# EAGLE design IO-001 (EAGLE 9.5.2)

## Sheet 1 of 3
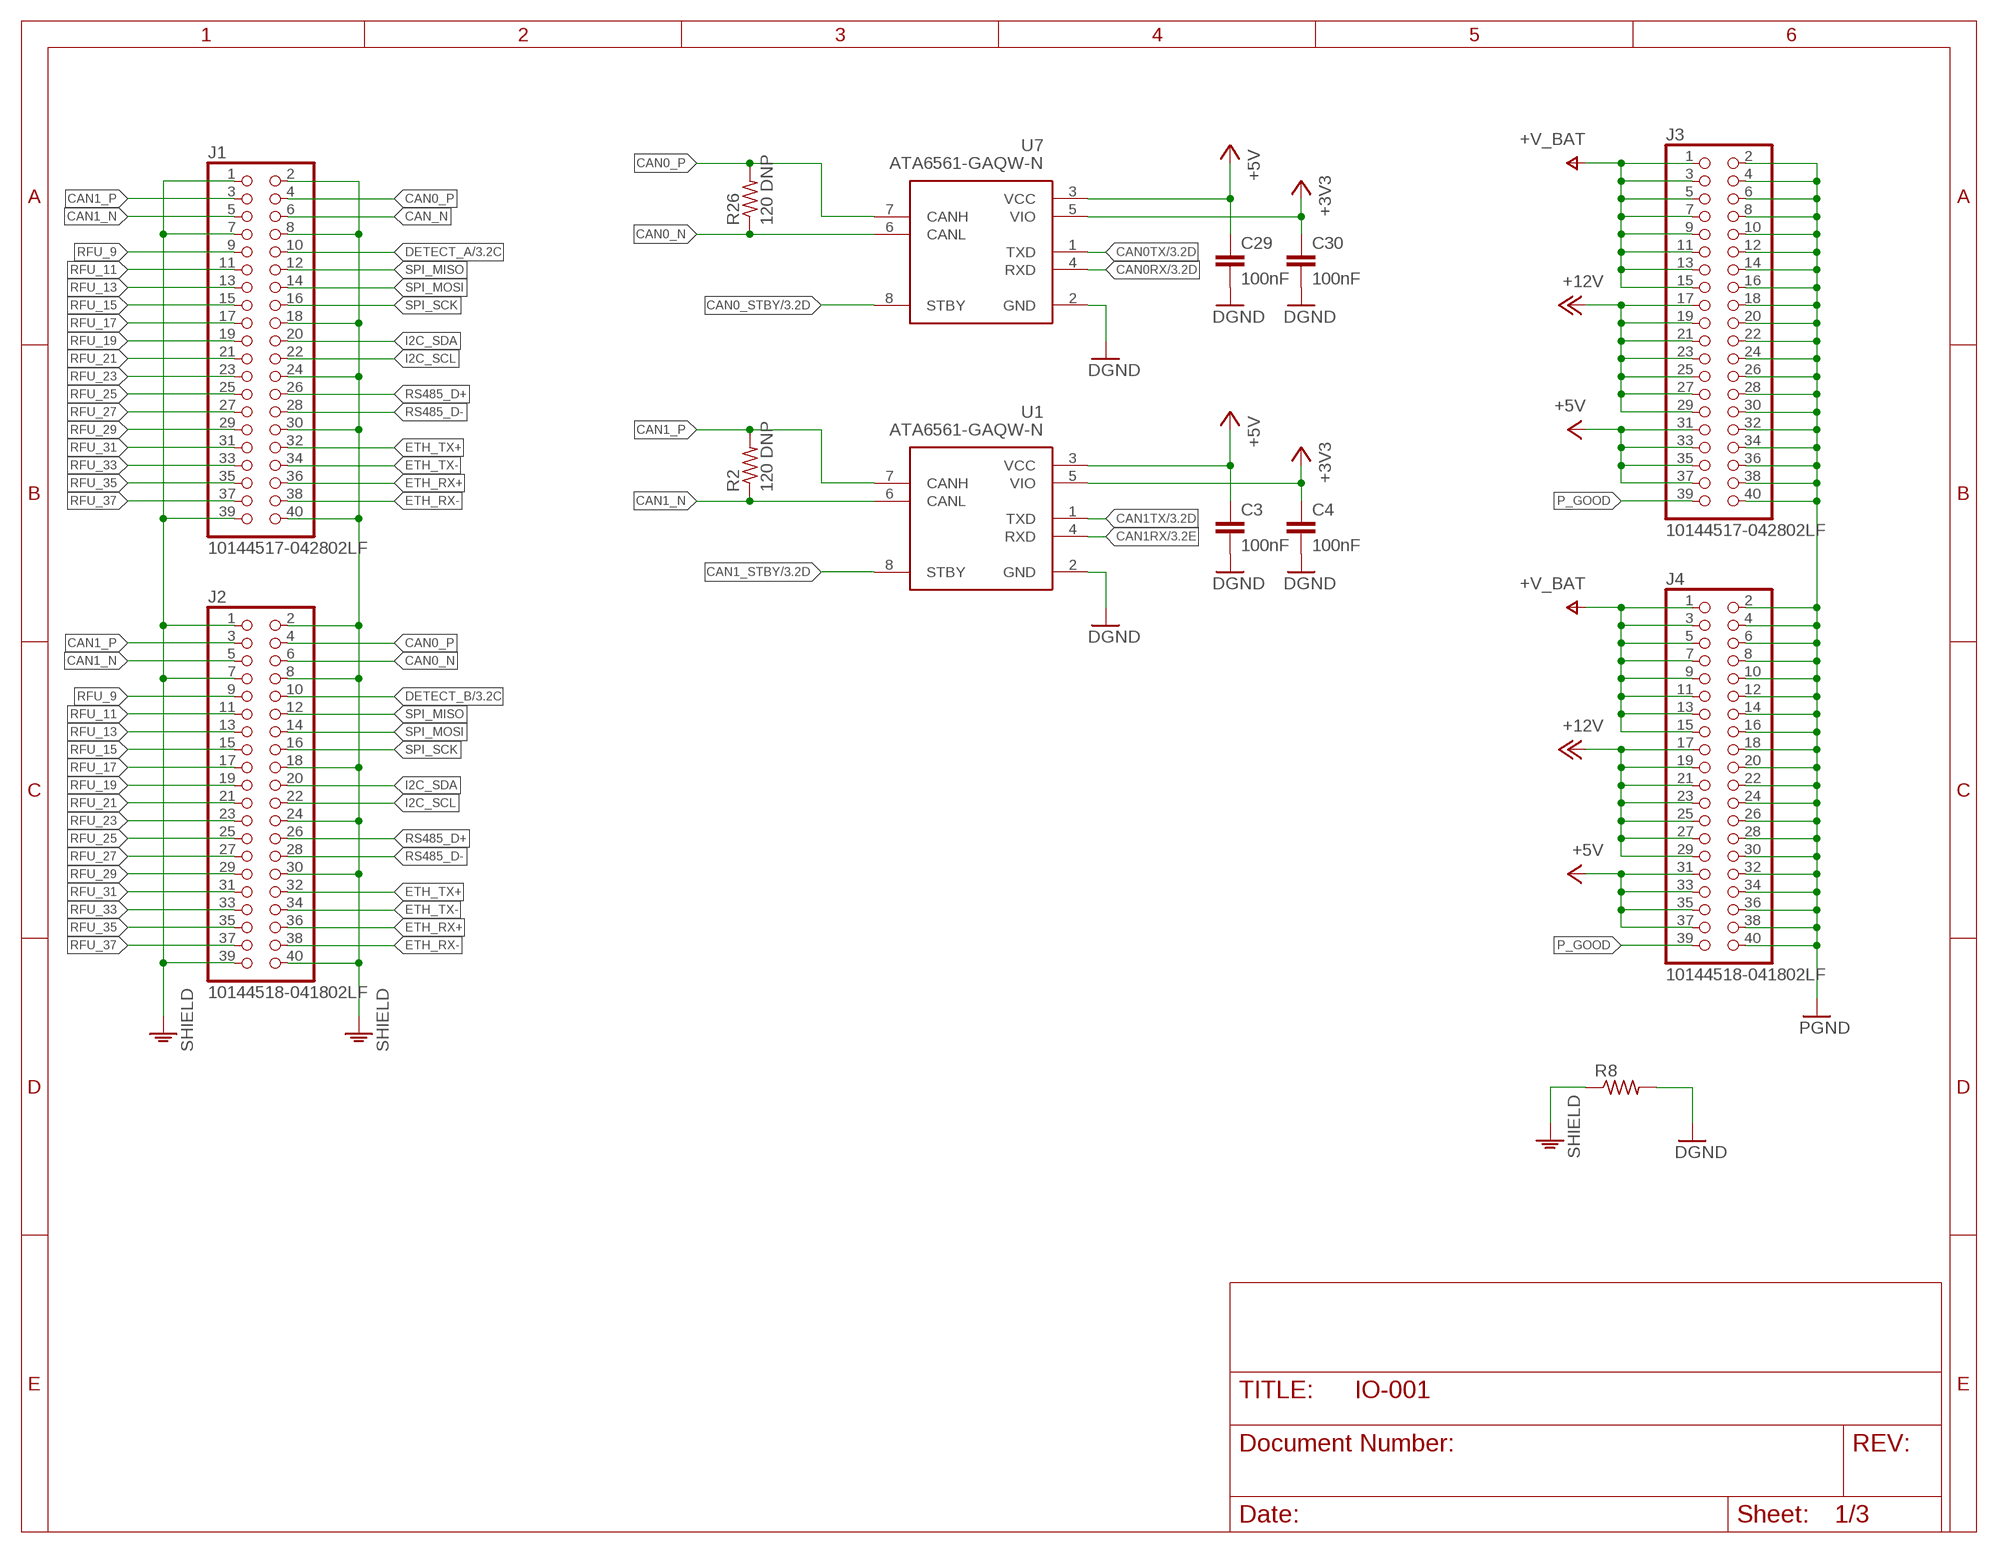
[diagram p0: schematic, sheet 1]

### Parts
C3  100nF  C-EUC0402  [C0402]
C4  100nF  C-EUC0402  [C0402]
C29  100nF  C-EUC0402  [C0402]
C30  100nF  C-EUC0402  [C0402]
J1  10144517-042802LF  [10144517-042802LF]
J2  10144518-041802LF  [10144518-041802LF]
J3  10144517-042802LF  [10144517-042802LF]
J4  10144518-041802LF  [10144518-041802LF]
R2  120 DNP  R-US_R0402  [R0402]
R8  R-US_R0402  [R0402]
R26  120 DNP  R-US_R0402  [R0402]
U1  ATA6561-GAQW-N  [SOIC127P600X175-8N]
U7  ATA6561-GAQW-N  [SOIC127P600X175-8N]

### Nets
+3V3: C4.1 C30.1 U1.5(VIO) U7.5(VIO) ; also sheet 2,3
+5V: C3.1 C29.1 J3.17 J3.19 J3.21 J3.23 J3.25 J3.27 J3.29 J3.31 J3.33 J3.35 J3.37 J4.17 J4.19 J4.21 J4.23 J4.25 J4.27 J4.29 J4.31 J4.33 J4.35 J4.37 U1.3(VCC) U7.3(VCC) ; supply symbol labelled +12V ; also sheet 2
+V_BAT: J3.1 J3.3 J3.5 J3.7 J3.9 J3.11 J3.13 J3.15 J4.1 J4.3 J4.5 J4.7 J4.9 J4.11 J4.13 J4.15
CAN0_N: J2.6 R26.1 U7.6(CANL)
CAN0_P: J1.4 J2.4 R26.2 U7.7(CANH)
CAN0_STBY: U7.8(STBY) ; also sheet 3
CAN0RX: U7.4(RXD) ; also sheet 3
CAN0TX: U7.1(TXD) ; also sheet 3
CAN1_N: J1.5 J2.5 R2.1 U1.6(CANL)
CAN1_P: J1.3 J2.3 R2.2 U1.7(CANH)
CAN1_STBY: U1.8(STBY) ; also sheet 3
CAN1RX: U1.4(RXD) ; also sheet 3
CAN1TX: U1.1(TXD) ; also sheet 3
CAN_N: J1.6
DETECT_A: J1.10 ; also sheet 3
DETECT_B: J2.10 ; also sheet 3
DGND: C3.2 C4.2 C29.2 C30.2 R8.2 U1.2(GND) U7.2(GND) ; also sheet 2,3
ETH_RX+: J1.36 J2.36
ETH_RX-: J1.38 J2.38
ETH_TX+: J1.32 J2.32
ETH_TX-: J1.34 J2.34
I2C_SCL: J1.22 J2.22
I2C_SDA: J1.20 J2.20
P_GOOD: J3.39 J4.39
PGND: J3.2 J3.4 J3.6 J3.8 J3.10 J3.12 J3.14 J3.16 J3.18 J3.20 J3.22 J3.24 J3.26 J3.28 J3.30 J3.32 J3.34 J3.36 J3.38 J3.40 J4.2 J4.4 J4.6 J4.8 J4.10 J4.12 J4.14 J4.16 J4.18 J4.20 J4.22 J4.24 J4.26 J4.28 J4.30 J4.32 J4.34 J4.36 J4.38 J4.40 ; also sheet 2
RFU_9: J1.9 J2.9
RFU_11: J1.11 J2.11
RFU_13: J1.13 J2.13
RFU_15: J1.15 J2.15
RFU_17: J1.17 J2.17
RFU_19: J1.19 J2.19
RFU_21: J1.21 J2.21
RFU_23: J1.23 J2.23
RFU_25: J1.25 J2.25
RFU_27: J1.27 J2.27
RFU_29: J1.29 J2.29
RFU_31: J1.31 J2.31
RFU_33: J1.33 J2.33
RFU_35: J1.35 J2.35
RFU_37: J1.37 J2.37
RS485_D+: J1.26 J2.26
RS485_D-: J1.28 J2.28
SHIELD: J1.1 J1.2 J1.7 J1.8 J1.18 J1.24 J1.30 J1.39 J1.40 J2.1 J2.2 J2.7 J2.8 J2.18 J2.24 J2.30 J2.39 J2.40 R8.1
SPI_MISO: J1.12 J2.12
SPI_MOSI: J1.14 J2.14
SPI_SCK: J1.16 J2.16

## Sheet 2 of 3
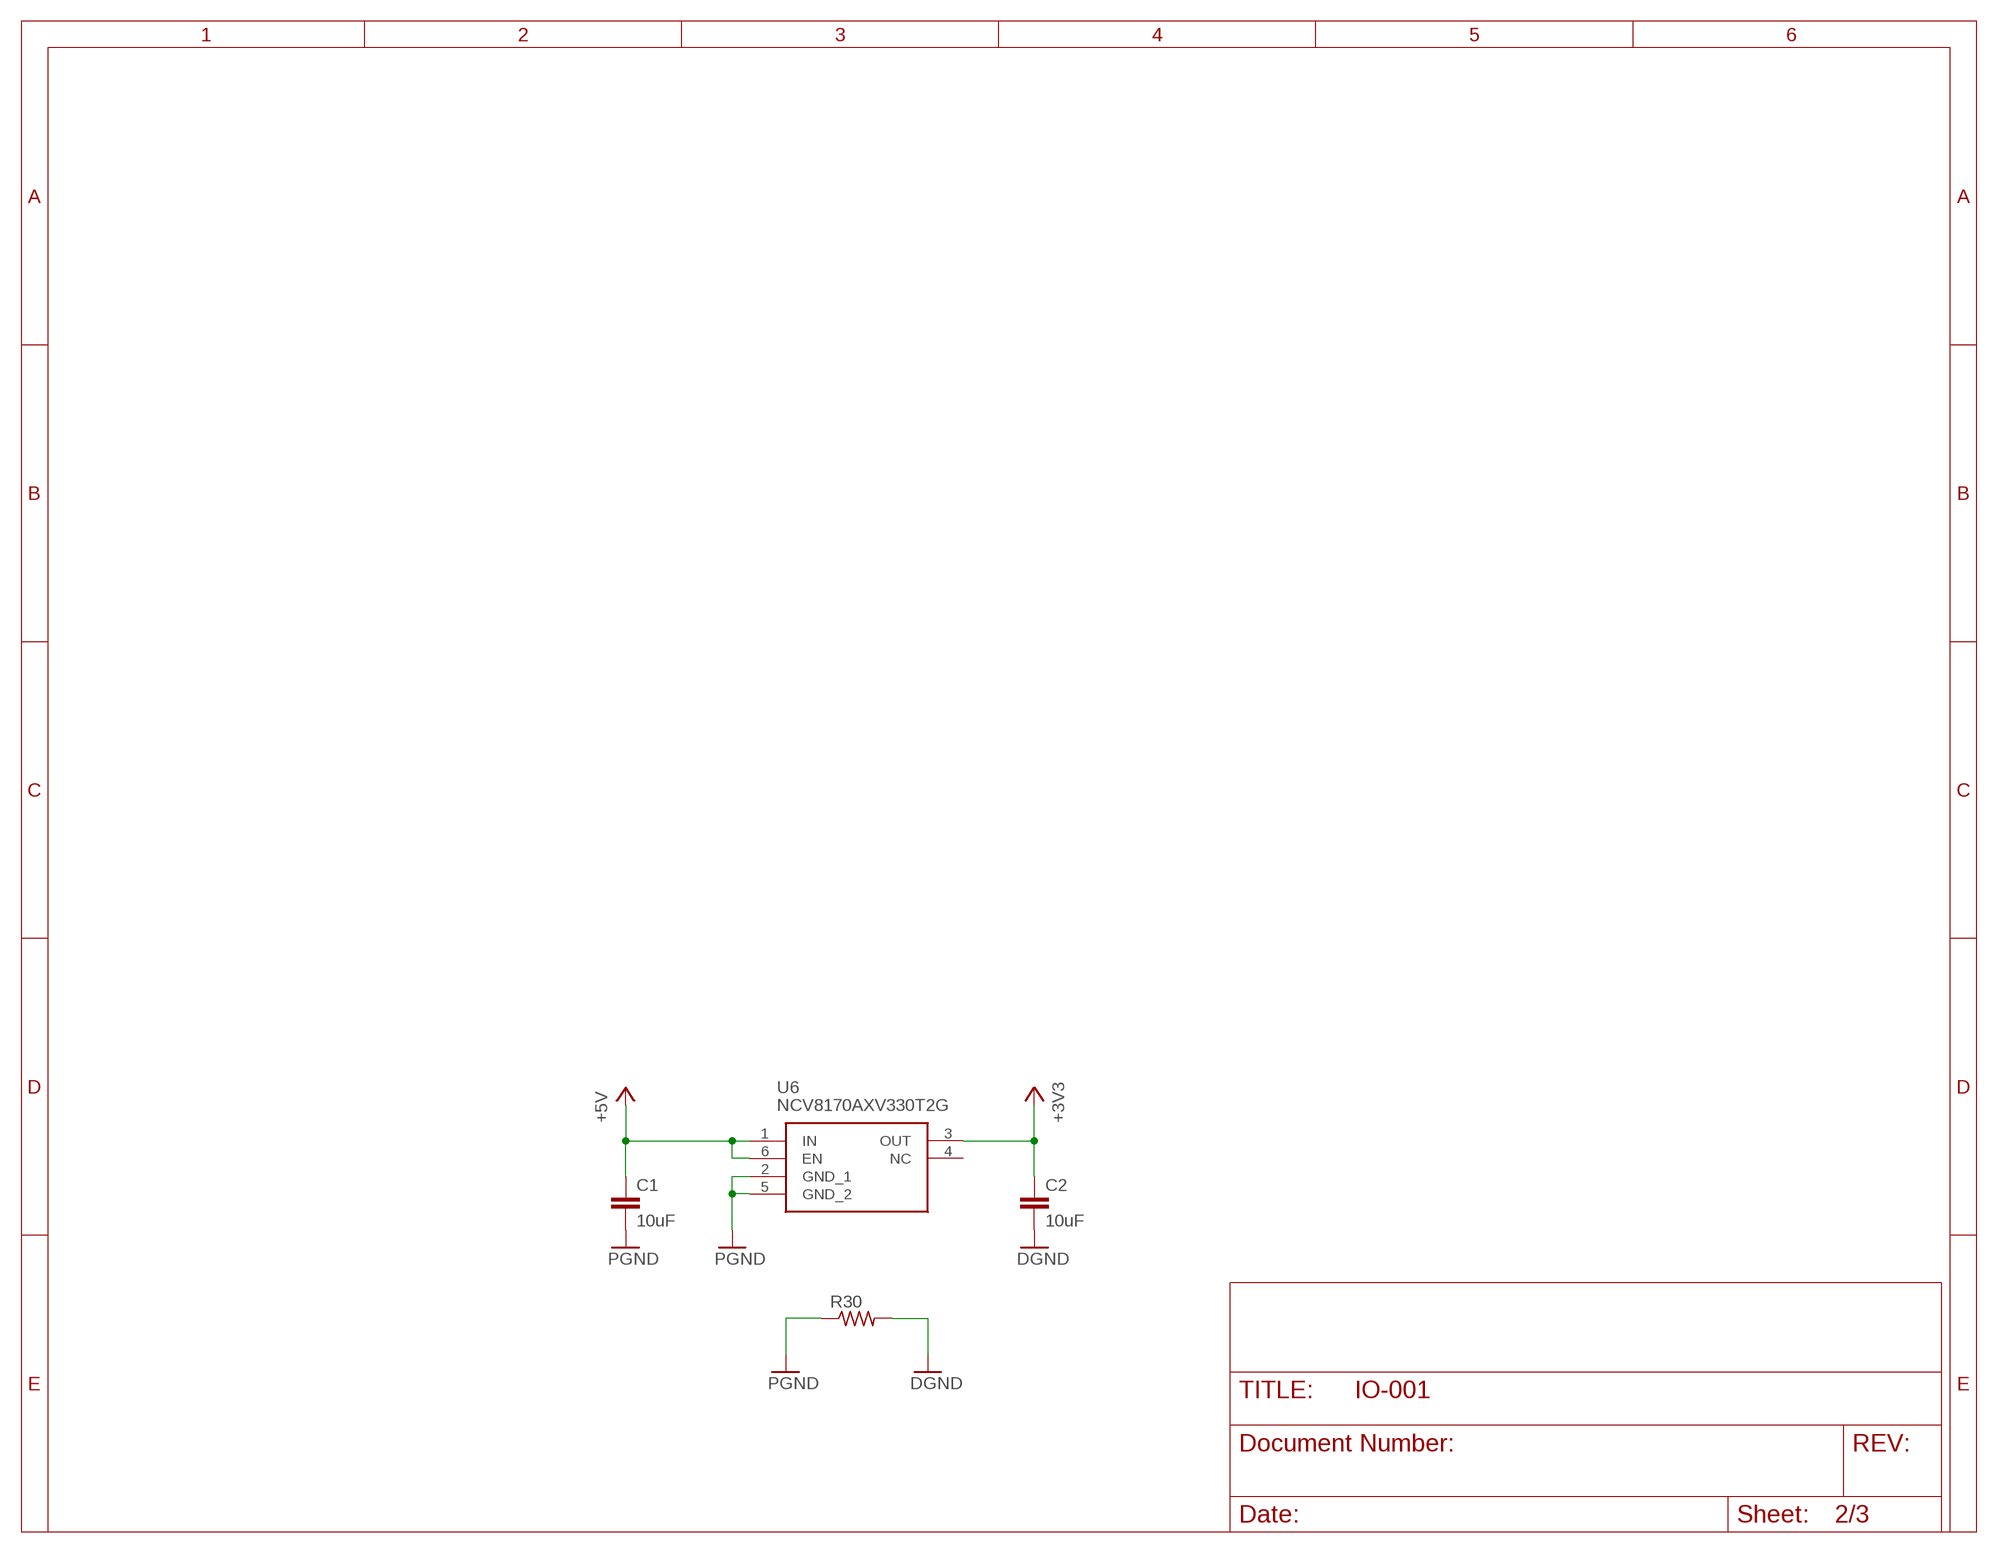
[diagram p1: schematic, sheet 2]

### Parts
C1  10uF  C-EUC0805  [C0805]
C2  10uF  C-EUC0805  [C0805]
R30  R-US_R0402  [R0402]
U6  NCV8170AXV330T2G  [SOTFL50P160X60-6N]

### Nets
+3V3: C2.1 U6.3(OUT) ; also sheet 1,3
+5V: C1.1 U6.1(IN) U6.6(EN) ; also sheet 1
DGND: C2.2 R30.2 ; also sheet 1,3
PGND: C1.2 R30.1 U6.2(GND_1) U6.5(GND_2) ; also sheet 1
Unconnected: U6.4(NC)

## Sheet 3 of 3
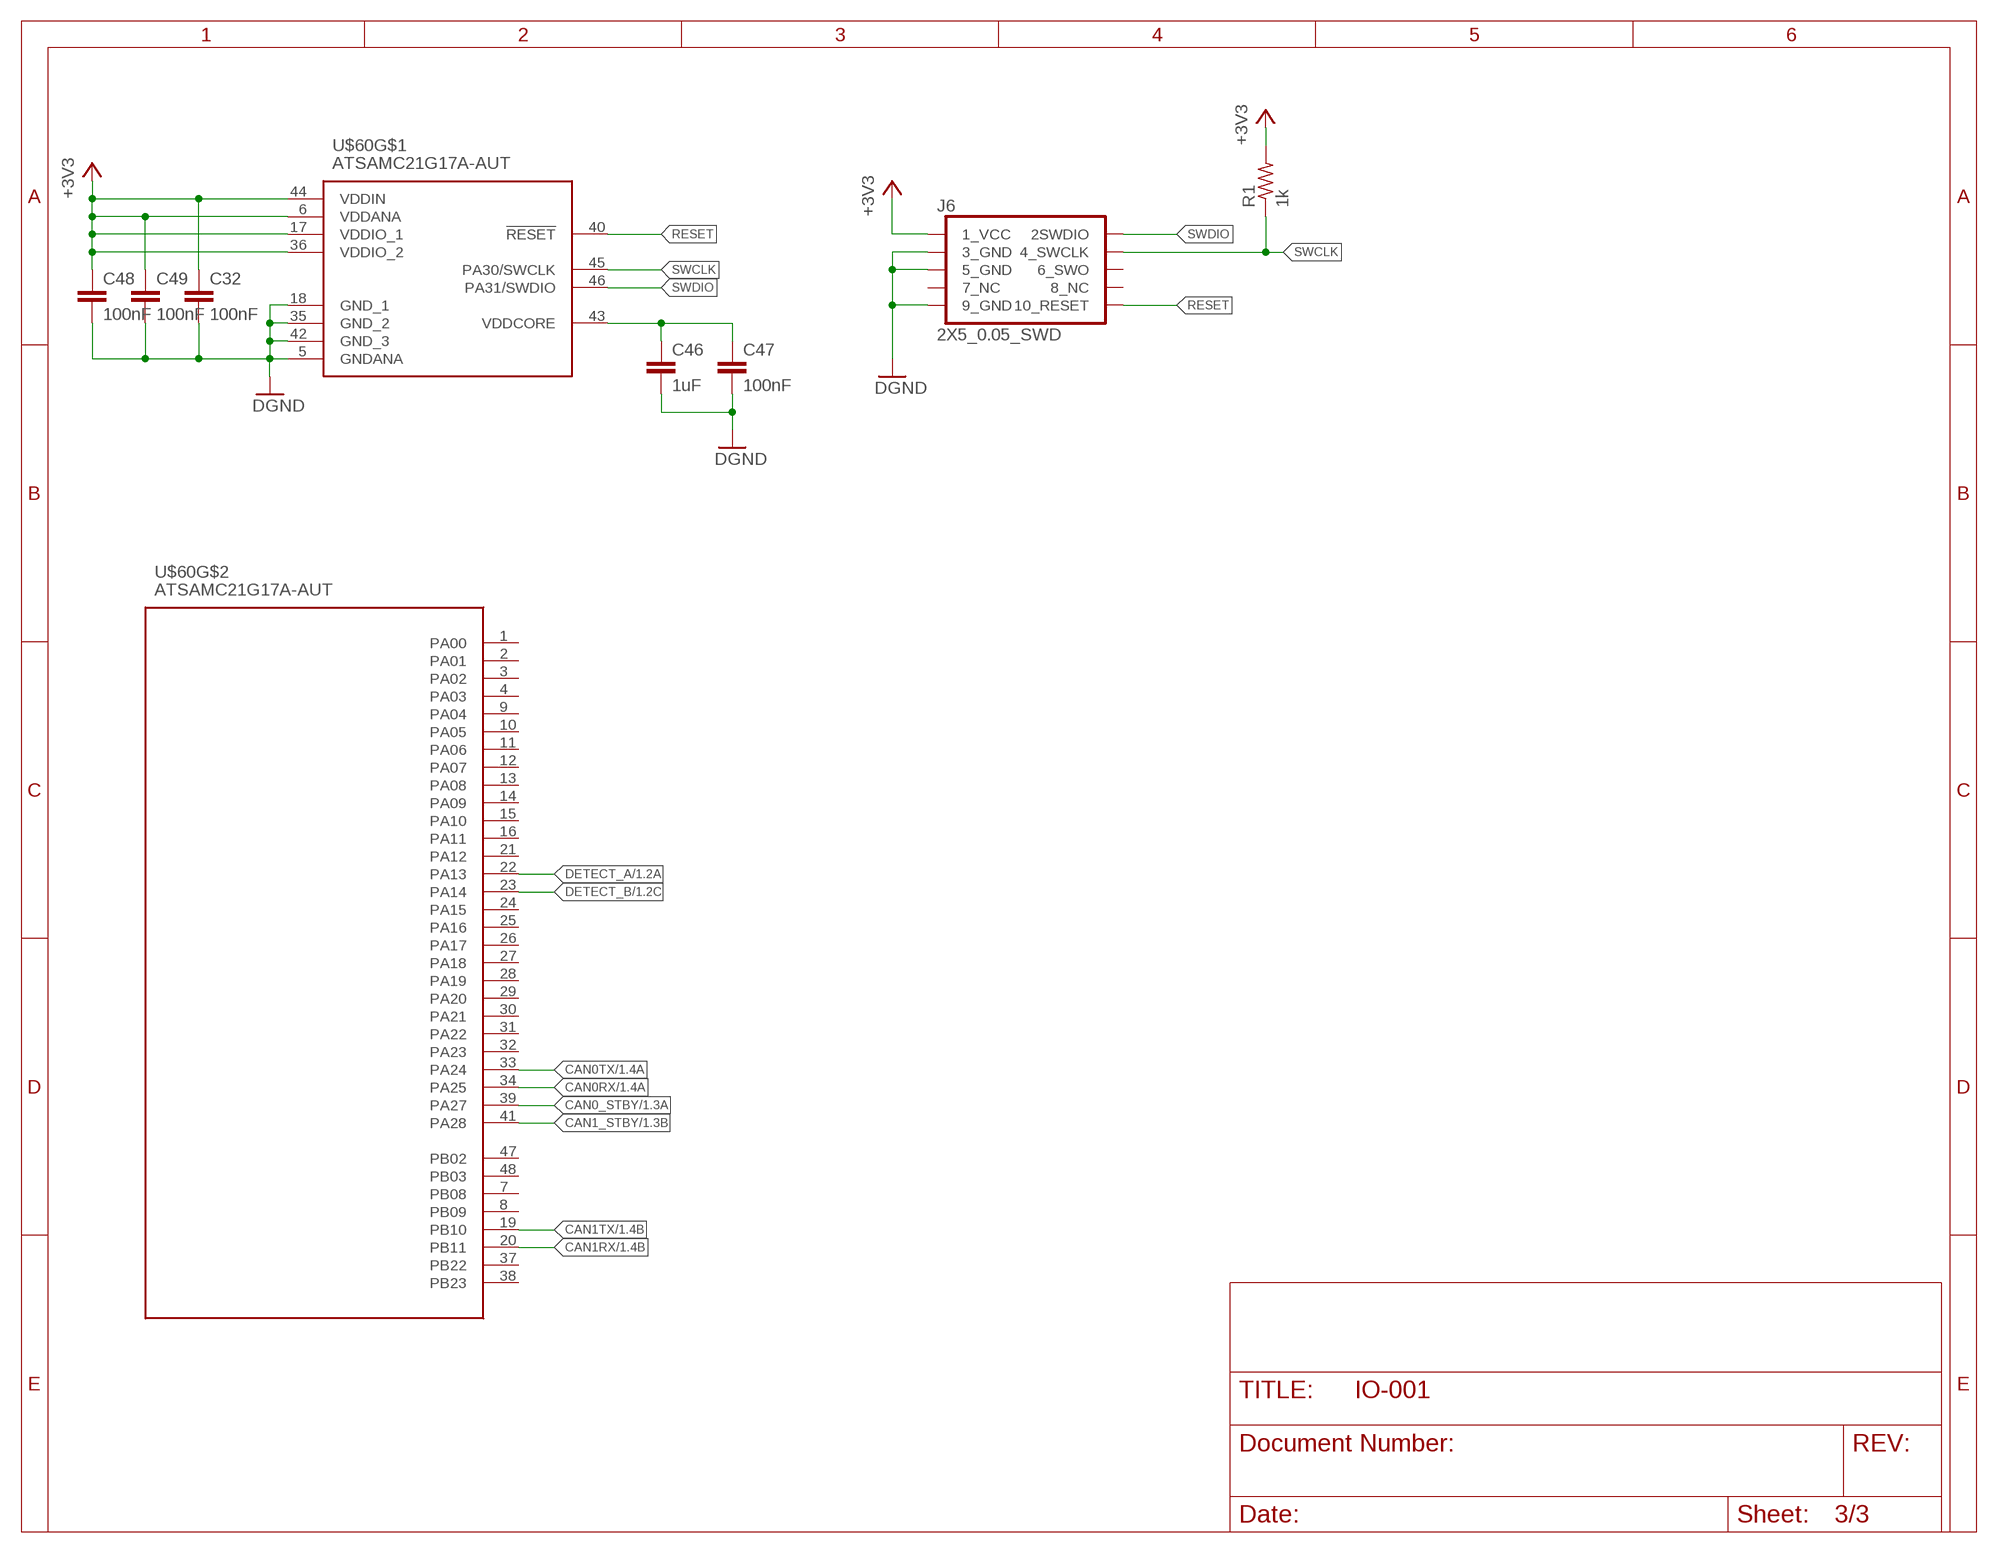
[diagram p2: schematic, sheet 3]

### Parts
C32  100nF  C-EUC0805  [C0805]
C46  1uF  C-EUC0805  [C0805]
C47  100nF  C-EUC0805  [C0805]
C48  100nF  C-EUC0805  [C0805]
C49  100nF  C-EUC0805  [C0805]
J6  2X5_0.05_SWD  [2X5_RIGHT]
R1  1k  R-US_R0402  [R0402]
U$60  ATSAMC21G17A-AUT  [QFP50P900X900X120-48N]

### Nets
+3V3: C32.1 C48.1 C49.1 J6.1(1_VCC) R1.2 U$60.6(VDDANA) U$60.17(VDDIO_1) U$60.36(VDDIO_2) U$60.44(VDDIN) ; also sheet 1,2
CAN0_STBY: U$60.39(PA27) ; also sheet 1
CAN0RX: U$60.34(PA25) ; also sheet 1
CAN0TX: U$60.33(PA24) ; also sheet 1
CAN1_STBY: U$60.41(PA28) ; also sheet 1
CAN1RX: U$60.20(PB11) ; also sheet 1
CAN1TX: U$60.19(PB10) ; also sheet 1
DETECT_A: U$60.22(PA13) ; also sheet 1
DETECT_B: U$60.23(PA14) ; also sheet 1
DGND: C32.2 C46.2 C47.2 C48.2 C49.2 J6.3(3_GND) J6.5(5_GND) J6.9(9_GND) U$60.5(GNDANA) U$60.18(GND_1) U$60.35(GND_2) U$60.42(GND_3) ; also sheet 1,2
N$29: C46.1 C47.1 U$60.43(VDDCORE)
RESET: J6.10(10_RESET) U$60.40(!RESET)
SWCLK: J6.4(4_SWCLK) R1.1 U$60.45(PA30/SWCLK)
SWDIO: J6.2(2SWDIO) U$60.46(PA31/SWDIO)
Unconnected: J6.6(6_SWO) J6.7(7_NC) J6.8(8_NC) U$60.1(PA00) U$60.2(PA01) U$60.3(PA02) U$60.4(PA03) U$60.7(PB08) U$60.8(PB09) U$60.9(PA04) U$60.10(PA05) U$60.11(PA06) U$60.12(PA07) U$60.13(PA08) U$60.14(PA09) U$60.15(PA10) U$60.16(PA11) U$60.21(PA12) U$60.24(PA15) U$60.25(PA16) U$60.26(PA17) U$60.27(PA18) U$60.28(PA19) U$60.29(PA20) U$60.30(PA21) U$60.31(PA22) U$60.32(PA23) U$60.37(PB22) U$60.38(PB23) U$60.47(PB02) U$60.48(PB03)

## Library data of the parts
C1-C4 C29 C30 C32 C46-C49 = rcl:C-EU: CAPACITOR, European symbol; SPICEPREFIX: C
J1 J3 = BergStak:10144517-04
J2 J4 = BergStak:10144518-04
J6 = Headers:2X5_0.05_SWD
R1 R2 R8 R26 R30 = rcl:R-US_: RESISTOR, American symbol; SPICEPREFIX: R
U1 U7 = SamacSys Managed:ATA6561-GAQW-N: MICROCHIP - ATA6561-GAQW-N - CAN TRANSCEIVER, 5MBPS, -40 TO 150DEG C Source: Datasheet <https://componentsearchengine.com/Datasheets/1/ATA6561-GAQW-N.pdf>; DESCRIPTION: MICROCHIP - ATA6561-GAQW-N - CAN TRANSCEIVER, 5MBPS, -40 TO 150DEG C; HEIGHT: 1.75mm; MANUFACTURER_NAME: Microchip; MANUFACTURER_PART_NUMBER: ATA6561-GAQW-N; MOUSER_PART_NUMBER: 579-ATA6561-GAQW-N; MOUSER_PRICE-STOCK: https://www.mouser.com/Search/Refine.aspx?Keyword=579-ATA6561-GAQW-N
U6 = SamacSys_Parts:NCV8170AXV330T2G: ON Semiconductor NCV8170AXV330T2G, LDO Voltage Regulator, 3.3 V +/-1%, 2.2 5.5 Vin, 6-Pin SOT-563 Source: Datasheet <https://componentsearchengine.com/Datasheets/1/NCV8170AXV330T2G.pdf>; DESCRIPTION: ON Semiconductor NCV8170AXV330T2G, LDO Voltage Regulator, 3.3 V +/-1%, 2.2 5.5 Vin, 6-Pin SOT-563; HEIGHT: 0.6mm; MANUFACTURER_NAME: ON Semiconductor; MANUFACTURER_PART_NUMBER: NCV8170AXV330T2G; MOUSER_PART_NUMBER: 863-NCV8170AXV330T2G; MOUSER_PRICE-STOCK: https://www.mouser.com/Search/Refine.aspx?Keyword=863-NCV8170AXV330T2G
U$60 = ATSAM:ATSAMC21G17A-AUT: ARM Microcontrollers - MCU 48TQFP,85C TEMP, GREEN, 5V, 48MHZ, T&R Source: Datasheet <http://ww1.microchip.com/downloads/en/DeviceDoc/SAMC20_C21_%20Family_Data_%20Sheet_DS60001479D.pdf>

## Board
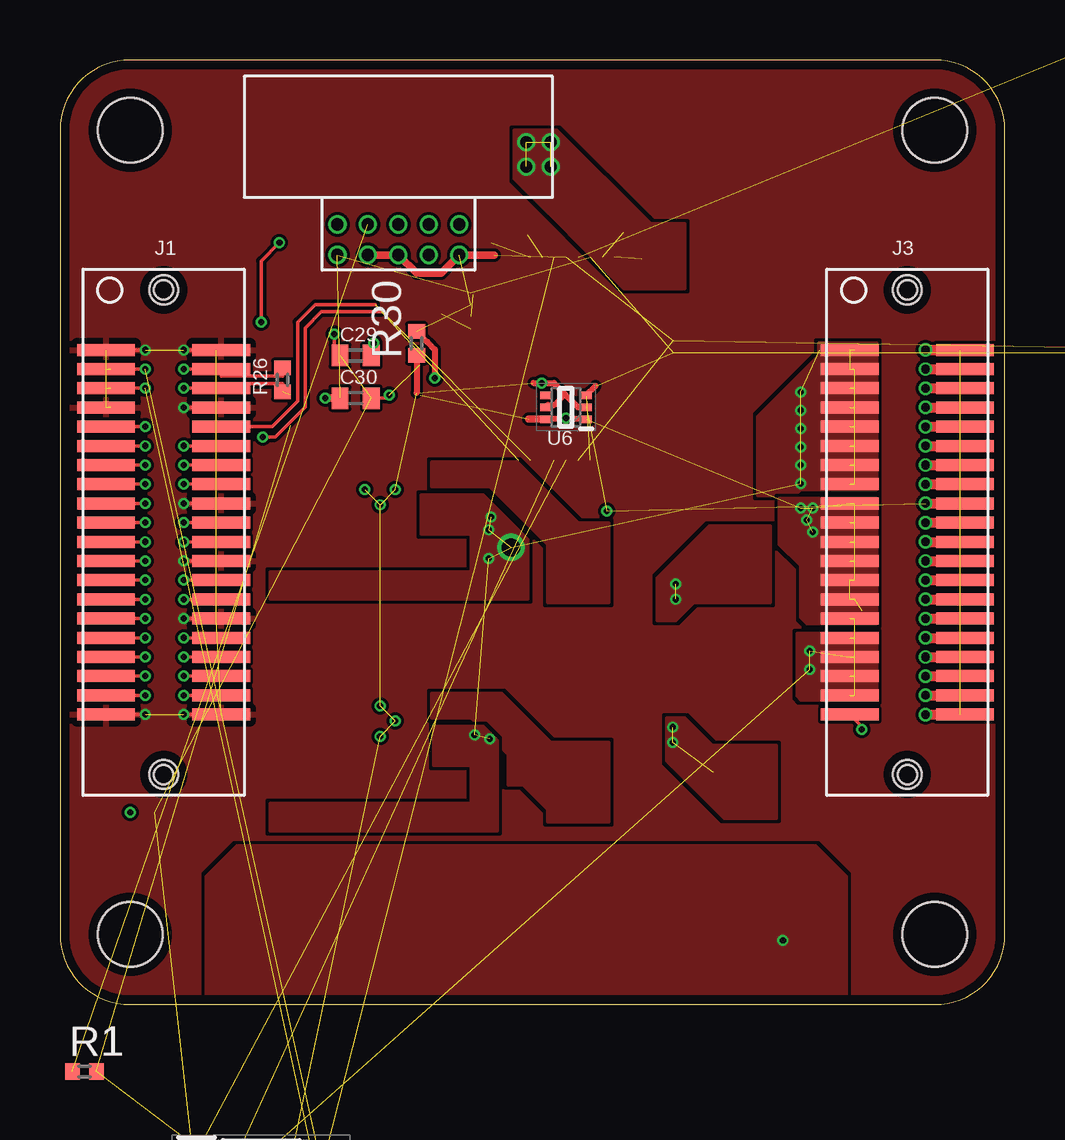
[diagram p3: board, top side]
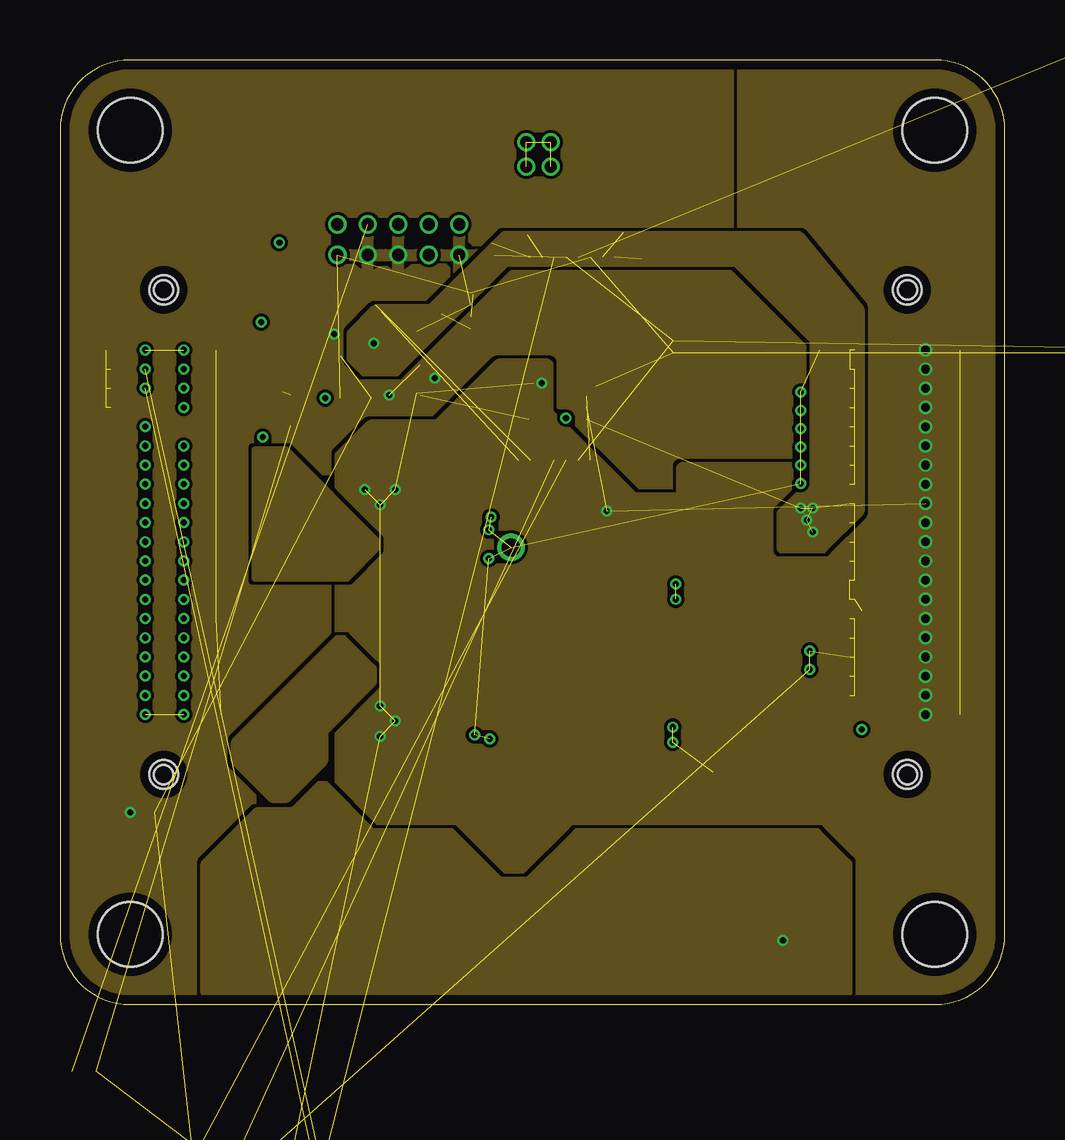
[diagram p4: board, inner layer Route2]
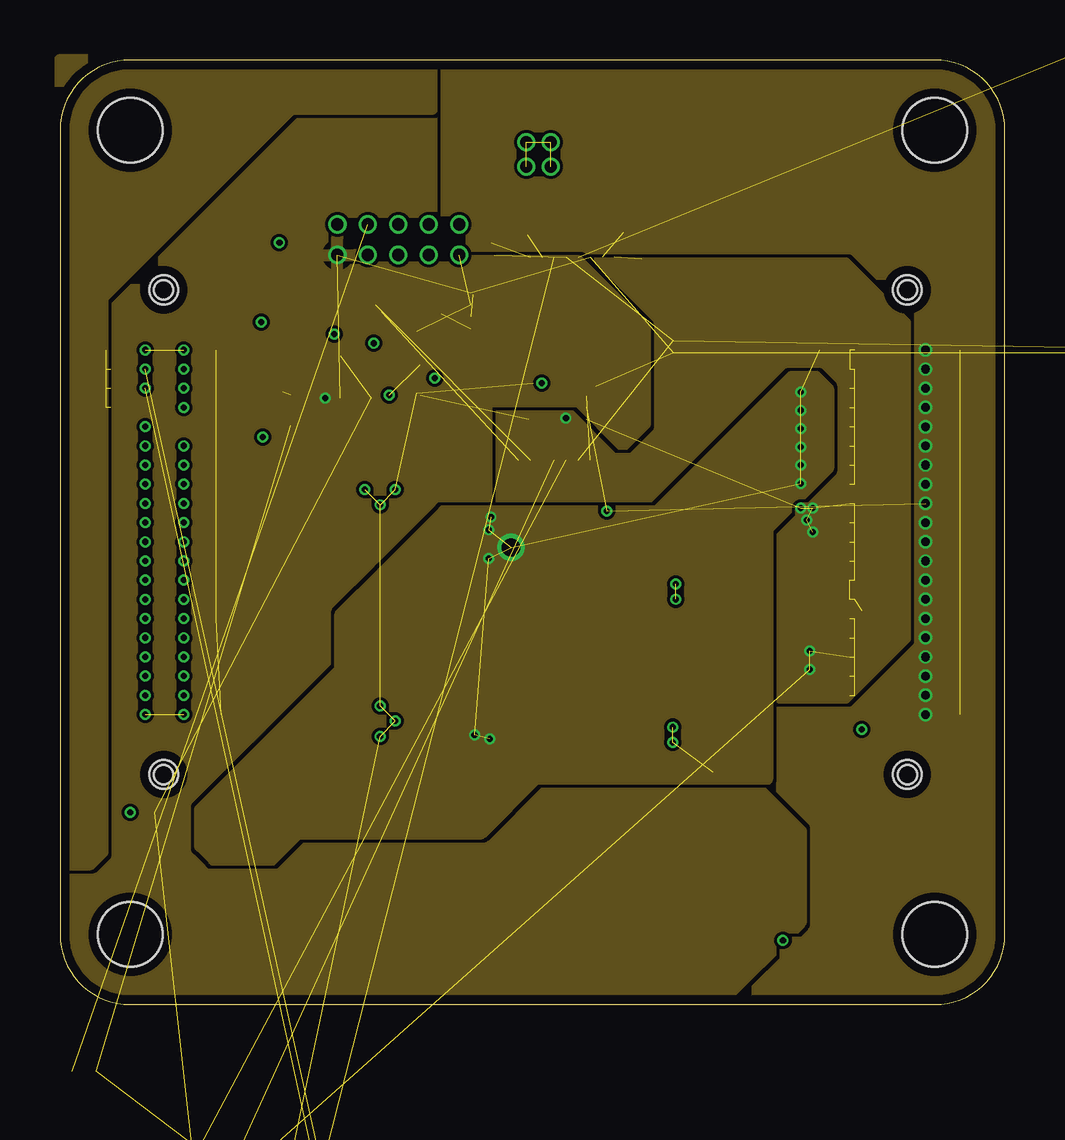
[diagram p5: board, inner layer Route15]
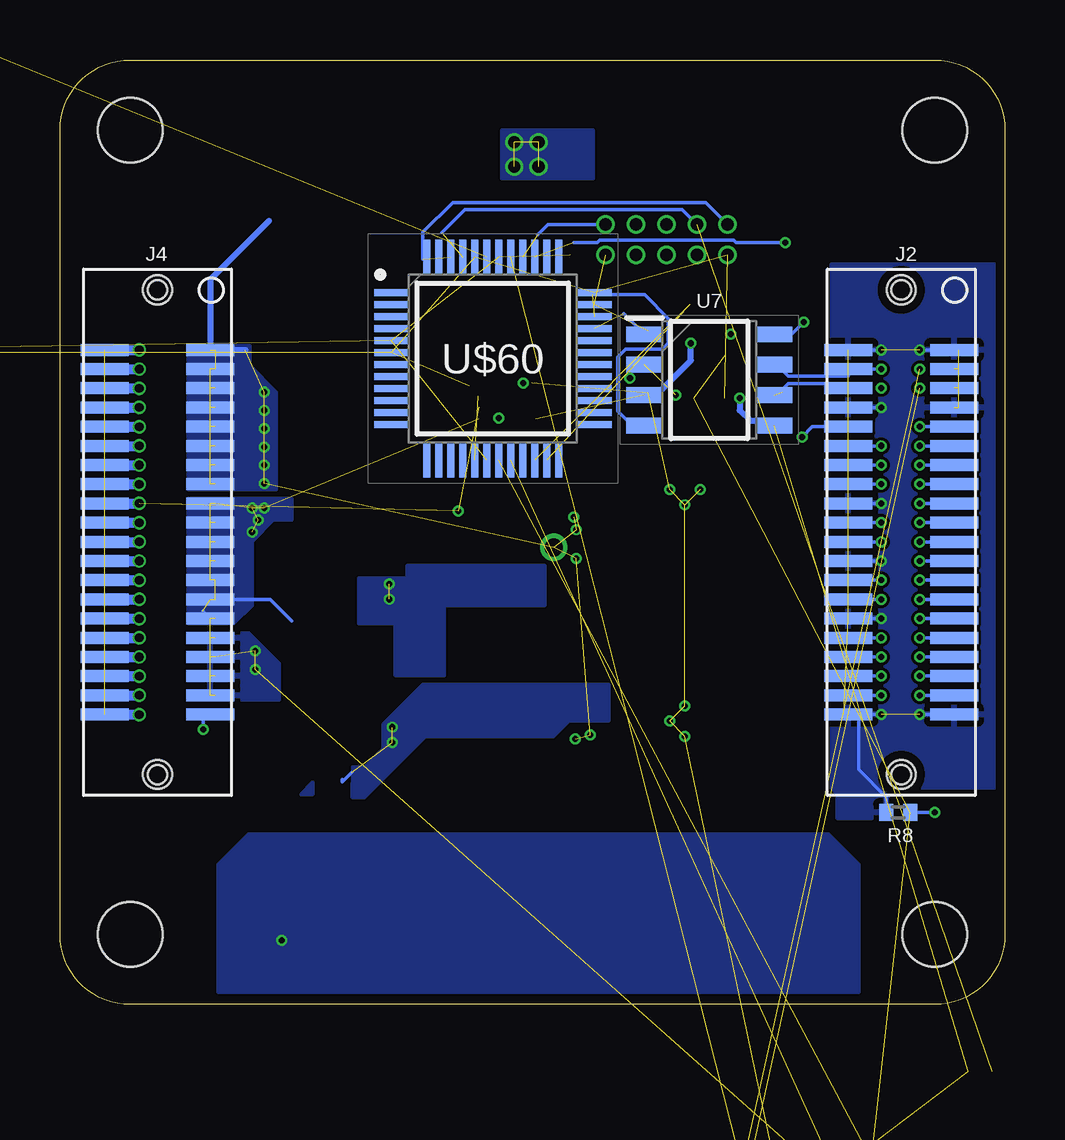
[diagram p6: board, bottom side, seen from below]

Size 39.37 x 39.37 mm. Coordinates in mm from the lower left corner, seen from the top.
Outline: 0,36.45 0,2.92 arc90 2.92,0 36.45,0 arc90 39.37,2.92 39.37,36.45 arc90 36.45,39.37 2.92,39.37 arc90 0,36.45
Copper layers (1*2*15*16): Top 0.035559375mm / dielectric 0.17018125mm / Route2 0.01778125mm / dielectric 47mil / Route15 0.01778125mm / dielectric 0.17018125mm / Bottom 0.035559375mm
Design rules "OSHPark-4layer *": minimum track width 6mil, minimum drill 10mil, track to track 5mil, track to pad 5mil, pad to pad 5mil, via to via 5mil, smd to smd 5mil, copper to edge 15mil, drill to drill 6mil, minimum pad ring 4mil, minimum via ring 4mil, stop-mask expansion 2.5mil, vias tented up to drill 14mil, thermal gap 10mil
Holes 2.69 mm at 2.92,36.45 36.45,36.45 36.45,2.92 2.92,2.92
vRestrict: area 0,0 to 5.8,5.8; area 33.5,0 to 39.4,5.8; area 33.5,33.5 to 39.4,39.4; area 0,33.5 to 5.8,39.4

### Footprints (pad centres in the part's own frame; a part is rotated, then mirrored left to right if it is on the bottom)
C0805 = smd 1.3 x 1.5: 1 -0.95,0; 2 0.95,0
C0402 = smd 0.7 x 0.9: 1 -0.65,0; 2 0.65,0
10144517-042802LF = smd 0.5 x 2.4: 1 7.6,2.4; 2 7.6,-2.4; 3 6.8,2.4; 4 6.8,-2.4; 5 6,2.4; 6 6,-2.4; 7 5.2,2.4; 8 5.2,-2.4; 9 4.4,2.4; 10 4.4,-2.4; 11 3.6,2.4; 12 3.6,-2.4; 13 2.8,2.4; 14 2.8,-2.4; 15 2,2.4; 16 2,-2.4; 17 1.2,2.4; 18 1.2,-2.4; 19 0.4,2.4; 20 0.4,-2.4; 21 -0.4,2.4; 22 -0.4,-2.4; 23 -1.2,2.4; 24 -1.2,-2.4; 25 -2,2.4; 26 -2,-2.4; 27 -2.8,2.4; 28 -2.8,-2.4; 29 -3.6,2.4; 30 -3.6,-2.4; 31 -4.4,2.4; 32 -4.4,-2.4; 33 -5.2,2.4; 34 -5.2,-2.4; 35 -6,2.4; 36 -6,-2.4; 37 -6.8,2.4; 38 -6.8,-2.4; 39 -7.6,2.4; 40 -7.6,-2.4 | hole 1.2: 10.1,0 | hole 0.8: -10.1,0
10144518-041802LF = smd 0.5 x 2: 1 -7.6,2.2; 2 -7.6,-2.2; 3 -6.8,2.2; 4 -6.8,-2.2; 5 -6,2.2; 6 -6,-2.2; 7 -5.2,2.2; 8 -5.2,-2.2; 9 -4.4,2.2; 10 -4.4,-2.2; 11 -3.6,2.2; 12 -3.6,-2.2; 13 -2.8,2.2; 14 -2.8,-2.2; 15 -2,2.2; 16 -2,-2.2; 17 -1.2,2.2; 18 -1.2,-2.2; 19 -0.4,2.2; 20 -0.4,-2.2; 21 0.4,2.2; 22 0.4,-2.2; 23 1.2,2.2; 24 1.2,-2.2; 25 2,2.2; 26 2,-2.2; 27 2.8,2.2; 28 2.8,-2.2; 29 3.6,2.2; 30 3.6,-2.2; 31 4.4,2.2; 32 4.4,-2.2; 33 5.2,2.2; 34 5.2,-2.2; 35 6,2.2; 36 6,-2.2; 37 6.8,2.2; 38 6.8,-2.2; 39 7.6,2.2; 40 7.6,-2.2 | hole 1.2: 10.1,0 | hole 0.8: -10.1,0
2X5_RIGHT = drill 0.508: 1 2.54,0; 2 2.54,-1.27; 3 1.27,0; 4 1.27,-1.27; 5 0,0; 6 0,-1.27; 7 -1.27,0; 8 -1.27,-1.27; 9 -2.54,0; 10 -2.54,-1.27
R0402 = smd 0.6 x 0.7: 1 -0.5,0; 2 0.5,0
SOIC127P600X175-8N = smd 1.5 x 0.65: 1 -2.7,1.905; 2 -2.7,0.635; 3 -2.7,-0.635; 4 -2.7,-1.905; 5 2.7,-1.905; 6 2.7,-0.635; 7 2.7,0.635; 8 2.7,1.905
SOTFL50P160X60-6N = smd 0.475 x 0.3: 1 -0.838,0.5; 2 -0.838,0; 3 -0.838,-0.5; 4 0.838,-0.5; 5 0.838,0; 6 0.838,0.5
QFP50P900X900X120-48N = smd 1.45 x 0.3: 1 -4.225,2.75; 2 -4.225,2.25; 3 -4.225,1.75; 4 -4.225,1.25; 5 -4.225,0.75; 6 -4.225,0.25; 7 -4.225,-0.25; 8 -4.225,-0.75; 9 -4.225,-1.25; 10 -4.225,-1.75; 11 -4.225,-2.25; 12 -4.225,-2.75; 25 4.225,-2.75; 26 4.225,-2.25; 27 4.225,-1.75; 28 4.225,-1.25; 29 4.225,-0.75; 30 4.225,-0.25; 31 4.225,0.25; 32 4.225,0.75; 33 4.225,1.25; 34 4.225,1.75; 35 4.225,2.25; 36 4.225,2.75 | smd 0.3 x 1.45: 13 -2.75,-4.225; 14 -2.25,-4.225; 15 -1.75,-4.225; 16 -1.25,-4.225; 17 -0.75,-4.225; 18 -0.25,-4.225; 19 0.25,-4.225; 20 0.75,-4.225; 21 1.25,-4.225; 22 1.75,-4.225; 23 2.25,-4.225; 24 2.75,-4.225; 37 2.75,4.225; 38 2.25,4.225; 39 1.75,4.225; 40 1.25,4.225; 41 0.75,4.225; 42 0.25,4.225; 43 -0.25,4.225; 44 -0.75,4.225; 45 -1.25,4.225; 46 -1.75,4.225; 47 -2.25,4.225; 48 -2.75,4.225

### Placement (x,y rotation side)
C1  1.78,-39.12 0 top  (outside the outline)
C2  1.78,-45.47 0 top  (outside the outline)
C3  1.27,-18.54 0 top  (outside the outline)
C4  7.87,-18.54 0 top  (outside the outline)
C29  12.32,27.05 180 top
C30  12.32,25.27 0 top
C32  57.4,27.18 0 bottom  (outside the outline)
C46  57.4,52.58 0 bottom  (outside the outline)
C47  57.4,46.23 0 bottom  (outside the outline)
C48  57.4,39.88 0 bottom  (outside the outline)
C49  57.4,33.53 0 bottom  (outside the outline)
J1  4.32,19.68 90 top
J2  4.32,19.68 270 bottom
J3  35.31,19.68 90 top
J4  35.31,19.68 270 bottom
J6  14.1,31.24 180 top
R1  1.02,-2.79 0 top
R2  1.02,-13.46 0 top  (outside the outline)
R8  4.45,8 0 bottom
R26  9.27,26.04 90 top
R30  14.86,27.56 90 top
U1  8.38,-8.13 0 top  (outside the outline)
U6  21.08,24.89 180 top
U7  12.32,26.04 0 bottom
U$60  21.34,26.92 0 bottom

### Tracks (layer width: path | path; a pad name or v marks a point on that pad's centre or on a via)
+3V3  (via drill 0.25)  (13 unrouted)
  Top 0.254: 21.95,25.37 U6.3 22.31,25.79
  Top 0.305: C30.1 v11.05,25.27
  Bottom 0.254: v11.05,25.27 11.05,24.77 10.62,24.33 9.82,24.33 U7.5
  pour Route15 (rank 3): 24.38,24.21 24.38,28.19 21.59,30.99 16,30.99 15.49,31.5 15.49,37.34 5.08,37.34 0,32.26 0,0 27.43,0 30.88,3.45 30.88,7.22 26.42,11.68 17.78,11.68 17.78,25.15 21.59,25.15 23.46,23.28
+5V  (via drill 0.25)  (32 unrouted)
  Top 0.254: U6.1 21.08,24.39 | 21.08,24.39 U6.6 | 21.08,24.39 v21.08,24.44
  Top 0.305: v13.08,27.56 13.08,27.16 C29.1 | U6.6 19.54,24.39
  Bottom 0.152: J4.29 33.43,16.41 | J4.27 30.6,16.89 29.71,15.99
  Bottom 0.254: U7.3 14.53,25.4 13.08,26.84 v13.08,27.56
  other vias: 31.24,14.73 31.24,13.97 30.86,20.7 31.37,20.7 31.11,20.19 31.37,19.68
  pour Top (no thermals): 34.04,15.47 30.71,15.47 30.71,12.85 30.86,12.7 34.04,12.7
  pour Route15 (rank 4): 15.49,21.08 29.97,21.08 29.97,12.7 32.77,12.7 35.31,15.24 35.31,28.45 32.77,30.99 15.49,30.99
  pour Bottom: 34.04,12.7 34.04,15.49 31.5,15.49 30.23,14.22 30.23,12.7
  pour Bottom (no thermals): 29.72,21.08 34.04,21.08 34.04,15.88 32.13,15.88 31.37,16.64 31.37,19.3 30.48,20.19 29.72,20.19
  pour Top (no thermals): 29.97,21.08 34.04,21.08 34.04,15.88 31.11,15.88 30.86,16.13 30.86,18.29 29.97,19.18
  pour Route2: 12.19,27.94 13.21,28.96 15.49,28.96 18.54,32 30.78,32 33.27,28.97 33.27,20.57 31.74,19.04 30.11,19.04 30.11,20.46 31.5,21.84 31.5,27.69 28.19,30.99 18.54,30.99 13.97,26.42 12.7,26.42 12.19,26.92
+5V_REG  (via drill 0.25)  (2 unrouted)
  Bottom 0.152: 27.22,9.66 27.61,9.27 27.61,9.39
  other vias: 25.53,11.56 25.53,10.92
  pour Bottom (no thermals): 16.51,13.34 24.26,13.34 25.91,11.69 25.91,10.67 26.67,9.91 27.18,9.91 27.19,8.64 26.67,8.64 24.13,11.18 18.8,11.18 18.16,11.81 16.51,11.81
  pour Top (no thermals): 29.84,10.79 27.18,10.79 26.04,11.94 25.27,11.94 25.27,10.16 27.69,7.75 29.84,7.75
+12V_REG  (via drill 0.25)  (1 unrouted)
  other vias: 25.65,17.53 25.65,16.89
  pour Bottom (no thermals): 19.18,18.29 24.89,18.29 24.89,17.78 26.92,17.78 26.92,15.88 25.4,15.88 25.4,13.72 23.37,13.72 23.37,16.64 19.18,16.64
  pour Top (no thermals): 29.59,19.94 27.05,19.94 24.89,17.78 24.89,16 25.65,16 26.42,16.76 29.59,16.76
+V_BAT  (via drill 0.25, 0.76)  (27 unrouted)
  Bottom 0.254: 30.67,32.65 33.11,30.22 J4.1 31.65,27.29
  other vias: 30.86,22.48 30.86,23.24 30.86,21.72 30.86,25.53 30.86,24.77 30.86,24 17.96,20.32 17.86,19.79 17.86,18.59 18.8,19.05 17.27,11.23 17.91,11.07
  pour Top (no thermals): 8.76,18.03 17.14,18.03 17.14,19.61 15.06,19.61 15.06,21.23 17.63,21.23 19.48,19.38 19.48,16.89 8.76,16.89
  pour Top (no thermals): 8.76,8.38 17.14,8.38 17.14,9.96 15.57,9.96 15.57,11.58 17.63,11.58 18.21,11 18.21,7.24 8.76,7.24
  pour Top (rank 2, no thermals): 29.08,24.51 29.08,21.21 30.61,21.21 30.86,21.46 34.04,21.46 34.04,27.56 31.62,27.56 31.62,27.05
  pour Bottom (no thermals): 30.35,25.53 30.35,21.46 34.04,21.46 34.04,27.46 31.47,27.46 31.47,26.64
  pour Route15 (no thermals): 16,20.57 24.89,20.57 30.48,26.16 31.5,26.16 32,25.65 32,22.35 29.46,19.81 29.46,9.4 19.81,9.4 17.53,7.11 9.91,7.11 8.81,6.02 6.43,6.02 5.84,6.6 5.84,8.13 11.68,13.97 11.68,16.26 13.46,18.03
+V_BAT_INT
  pour Route15: 15.49,39.37 0,39.37 0,5.84 1.27,5.84 1.78,6.35 1.78,29.46 9.65,37.34 15.49,37.34
AGND  (via drill 0.25)
  other vias: 30.12,2.67
  pour Top: 6.1,0 6.1,5.33 7.37,6.6 31.5,6.6 32.77,5.33 32.77,0
  pour Route2: 6.1,0.51 6.1,5.84 8.23,7.98 9.75,7.98 10.92,9.14 12.95,7.11 16.26,7.11 18.29,5.08 19.56,5.08 21.59,7.11 31.5,7.11 32.77,5.84 32.77,0.51
  pour Bottom: 32.77,0.51 32.77,5.84 31.5,7.11 7.37,7.11 6.1,5.84 6.1,0.51
CAN0_N  (2 unrouted)
  Bottom 0.152: 6.52,25.88 9.02,25.88 9.5,25.4 U7.6
CAN0_P  (via drill 0.25)
  Top 0.152: R26.2 9.27,26.19 6.72,26.19 J1.4 v5.15,26.48
  Bottom 0.152: U7.7 9.5,26.67 9.02,26.19 6.52,26.19 J2.4 v5.15,26.48
CAN0_STBY  (via drill 0.25)  (1 unrouted)
  Top 0.152: v9.14,31.75 8.38,30.99 v8.38,28.45
  Bottom 0.152: v9.14,31.75 11.2,31.75 11.3,31.85 16.89,31.85 16.99,31.75 17.96,31.75 | U7.8 8.89,27.94 v8.38,28.45
CAN0RX  (1 unrouted)
  Bottom 0.152: 17.2,29.58 15.01,29.58 14.02,28.59 14.02,27.57 14.26,27.32 15.79,27.32 16.12,26.99 16.12,24.73 15.53,24.13 U7.4
CAN0TX  (1 unrouted)
  Bottom 0.152: 15.88,28.8 U7.1
CAN1_N  (via drill 0.25)  (3 unrouted)
  Top 0.152: J1.5 v3.55,25.68
CAN1_P  (via drill 0.25)  (3 unrouted)
  Top 0.152: J1.3 v3.55,26.48
CAN1_STBY  (1 unrouted)
CAN1RX  (1 unrouted)
CAN1TX  (1 unrouted)
CAN_N  (via drill 0.25)
  Top 0.152: 9.27,25.88 6.72,25.88 J1.6 v5.15,25.68
DETECT_A  (1 unrouted)
  Top 0.152: 13.13,29.18 10.64,29.18 9.91,28.45 9.91,25.15 8.85,24.09 J1.10
DETECT_B  (via drill 0.25)  (1 unrouted)
  Top 0.152: v8.45,23.65 8.96,23.65 10.21,24.9 10.21,28.19 10.89,28.88 13.38,28.88
  Bottom 0.152: v8.45,23.65 8.02,24.09 J2.10
DGND  (via drill 0.25)  (17 unrouted)
  Top 0.152: C29.2 11.43,27.29 v11.43,27.94 | C30.2 13.59,25.27 v13.72,25.4
  Top 0.254: R30.2 15.3,27.61 15.31,27.61 15.62,27.31 v15.62,26.11
  Top 0.305: 18.1,31.24 J6.9 15.88,30.48 14.86,30.48 J6.5 J6.3
  Bottom 0.152: v15.62,26.11 15.62,26.49 15.44,26.67 U7.2 | R8.2 v2.92,8
  pour Route2 (rank 3): 0,39.37 39.37,39.37 39.37,0 0,0
ETH_RX+  (via drill 0.25)
  Top 0.152: v5.15,13.69 J1.36
  Bottom 0.152: J2.36 v5.15,13.69
ETH_RX-  (via drill 0.25)
  Top 0.152: v5.15,12.88 J1.38
  Bottom 0.152: J2.38 v5.15,12.88
ETH_TX+  (via drill 0.25)
  Top 0.152: v5.15,15.29 J1.32
  Bottom 0.152: J2.32 v5.15,15.29
ETH_TX-  (via drill 0.25)
  Top 0.152: v5.15,14.48 J1.34
  Bottom 0.152: J2.34 v5.15,14.48
GND1
  pour Route2: 8.13,23.11 8.13,17.78 11.94,17.78 13.21,19.05 13.21,19.3 9.4,23.11
GND2
  pour Route2: 7.37,10.16 7.37,10.92 11.68,15.24 12.95,13.97 12.95,13.46 10.92,11.43 10.92,10.16 9.4,8.64 8.89,8.64
I2C_SCL  (via drill 0.25)
  Top 0.152: v5.15,19.29 J1.22
  Bottom 0.152: J2.22 v5.15,19.29
I2C_SDA  (via drill 0.25)
  Top 0.152: v5.15,20.09 J1.20
  Bottom 0.152: J2.20 v5.15,20.09
N$4
  pour Top (rank 2, no thermals): 15.49,22.61 19.05,22.61 21.59,20.07 22.86,20.07 22.86,16.76 20.32,16.76 20.32,19.18 17.91,21.59 15.49,21.59
N$5
  pour Top (rank 2, no thermals): 15.49,12.95 18.41,12.95 20.45,10.92 22.86,10.92 22.86,7.62 20.32,7.62 20.32,8.13 19.3,9.14 18.67,9.14 18.67,10.41 17.14,11.94 15.49,11.94
N$12
  pour Bottom (no thermals): 28.83,9.27 29.34,8.76 28.83,8.76
N$19  (via drill 0.51)  (3 unrouted)
  other vias: 19.43,35.94 20.45,35.94 19.43,34.92 20.45,34.92
  pour Top (no thermals): 18.92,34.42 23.5,29.84 26.04,29.84 26.04,32.54 24.61,32.54 20.7,36.45 18.92,36.45
  pour Bottom (no thermals): 17.14,36.45 20.95,36.45 20.95,34.42 17.14,34.42
N$29  (2 unrouted)
P_GOOD  (via drill 0.25)
  Top 0.152: J3.39 33.4,11.59 v33.4,11.46
  Bottom 0.152: J4.39 33.4,12.09 v33.4,11.46
PGND  (via drill 0.25, 0.36)  (29 unrouted)
  Top 0.254: 19.72,25.91 v20.07,25.91 20.57,25.91 21.08,25.4 | R30.1 14.86,25.49 | U6.5 20.34,24.99 20.59,24.99 21,25.4 21.08,25.4 | U6.2 21.59,24.89 21.08,25.4
  Top 0.406: v36.07,27.29 J3.2 | v36.07,26.48 J3.4 | v36.07,25.68 J3.6 | v36.07,24.89 J3.8 | v36.07,14.48 J3.34 | v36.07,13.69 J3.36 | v36.07,12.88 J3.38 | v36.07,12.09 J3.40 | v36.07,17.68 J3.26 | v36.07,16.89 J3.28 | v36.07,16.09 J3.30 | v36.07,15.29 J3.32 | v36.07,20.89 J3.18 | v36.07,20.09 J3.20 | v36.07,19.29 J3.22 | v36.07,18.48 J3.24 | v36.07,24.09 J3.10 | v36.07,23.29 J3.12 | v36.07,22.48 J3.14 | v36.07,21.68 J3.16
  Bottom 0.406: J4.2 v36.07,27.29 | J4.4 v36.07,26.48 | J4.6 v36.07,25.68 | J4.8 v36.07,24.89 | J4.34 v36.07,14.48 | J4.36 v36.07,13.69 | J4.38 v36.07,12.88 | J4.40 v36.07,12.09 | J4.26 v36.07,17.68 | J4.28 v36.07,16.89 | J4.30 v36.07,16.09 | J4.32 v36.07,15.29 | J4.18 v36.07,20.89 | J4.20 v36.07,20.09 | J4.22 v36.07,19.29 | J4.24 v36.07,18.48 | J4.10 v36.07,24.09 | J4.12 v36.07,23.29 | J4.14 v36.07,22.48 | J4.16 v36.07,21.68
  other vias: 13.34,20.83 13.97,21.46 12.7,21.46 13.34,11.18 13.34,12.45 13.97,11.81 22.78,20.57
  pour Route2 (rank 2, no thermals): 11.68,22.86 11.68,0 39.37,0 39.37,39.37 28.45,39.37 28.45,32.26 32.77,27.94 32.77,22.92 32.26,22.35 25.91,22.35 25.91,21.08 23.88,21.08 20.32,24.64 20.32,26.67 18.29,26.67 15.75,24.13 12.95,24.13
  pour Route15 (rank 5): 13.72,39.37 39.37,39.37 39.37,7.87 39.37,0 23.11,0 13.72,0
RESET  (1 unrouted)
  Bottom 0.152: 19.46,32.1 19.05,32.51 J6.10
RFU_9  (via drill 0.25)
  Top 0.152: J1.9 v3.55,24.09
  Bottom 0.152: J2.9 v3.55,24.09
RFU_11  (via drill 0.25)
  Top 0.152: J1.11 v3.55,23.29
  Bottom 0.152: J2.11 v3.55,23.29
RFU_13  (via drill 0.25)
  Top 0.152: J1.13 v3.55,22.48
  Bottom 0.152: J2.13 v3.55,22.48
RFU_15  (via drill 0.25)
  Top 0.152: J1.15 v3.55,21.68
  Bottom 0.152: J2.15 v3.55,21.68
RFU_17  (via drill 0.25)
  Top 0.152: J1.17 v3.55,20.89
  Bottom 0.152: J2.17 v3.55,20.89
RFU_19  (via drill 0.25)
  Top 0.152: J1.19 v3.55,20.09
  Bottom 0.152: J2.19 v3.55,20.09
RFU_21  (via drill 0.25)
  Top 0.152: J1.21 v3.55,19.29
  Bottom 0.152: J2.21 v3.55,19.29
RFU_23  (via drill 0.25)
  Top 0.152: J1.23 v3.55,18.48
  Bottom 0.152: J2.23 v3.55,18.48
RFU_25  (via drill 0.25)
  Top 0.152: J1.25 v3.55,17.68
  Bottom 0.152: J2.25 v3.55,17.68
RFU_27  (via drill 0.25)
  Top 0.152: J1.27 v3.55,16.89
  Bottom 0.152: J2.27 v3.55,16.89
RFU_29  (via drill 0.25)
  Top 0.152: J1.29 v3.55,16.09
  Bottom 0.152: J2.29 v3.55,16.09
RFU_31  (via drill 0.25)
  Top 0.152: J1.31 v3.55,15.29
  Bottom 0.152: J2.31 v3.55,15.29
RFU_33  (via drill 0.25)
  Top 0.152: J1.33 v3.55,14.48
  Bottom 0.152: J2.33 v3.55,14.48
RFU_35  (via drill 0.25)
  Top 0.152: J1.35 v3.55,13.69
  Bottom 0.152: J2.35 v3.55,13.69
RFU_37  (via drill 0.25)
  Top 0.152: J1.37 v3.55,12.88
  Bottom 0.152: J2.37 v3.55,12.88
RS485_D+  (via drill 0.25)
  Top 0.152: v5.15,17.68 J1.26
  Bottom 0.152: J2.26 v5.15,17.68
RS485_D-  (via drill 0.25)
  Top 0.152: v5.15,16.89 J1.28
  Bottom 0.152: J2.28 v5.15,16.89
SHIELD  (via drill 0.25)  (9 unrouted)
  Top 0.152: J1.1 v3.55,27.29 | v5.15,12.09 J1.40 | J1.39 v3.55,12.09 | v5.15,16.09 J1.30 | v5.15,18.48 J1.24 | v5.15,20.89 J1.18 | v5.15,24.89 J1.8 | v5.15,27.29 J1.2
  Bottom 0.152: J2.1 v3.55,27.29 | J2.40 6.1,12.09 | 6.1,12.09 v5.15,12.09 | J2.39 v3.55,12.09 | J2.30 v5.15,16.09 | J2.24 v5.15,18.48 | J2.18 v5.15,20.89 | J2.8 v5.15,24.89 | J2.2 v5.15,27.29 | R8.1 4.95,8.64 6.1,9.79 6.1,12.09
  pour Bottom (rank 4): 0,30.86 7.24,30.86 7.24,9.02 6.99,8.76 6.99,7.75 5.46,7.75 4.19,9.02 3.56,9.02 0,9.02
  pour Top (rank 4): 39.37,39.37 0,39.37 0,0 39.37,0
SPI_MISO  (via drill 0.25)
  Top 0.152: v5.15,23.29 J1.12
  Bottom 0.152: J2.12 v5.15,23.29
SPI_MOSI  (via drill 0.25)
  Top 0.152: v5.15,22.48 J1.14
  Bottom 0.152: J2.14 v5.15,22.48
SPI_SCK  (via drill 0.25)
  Top 0.152: v5.15,21.68 J1.16
  Bottom 0.152: J2.16 v5.15,21.68
SWCLK  (2 unrouted)
  Bottom 0.152: J6.4 13.44,33.12 22.5,33.12 23.46,32.16
SWDIO  (1 unrouted)
  Bottom 0.152: J6.2 12.47,33.43 23.01,33.43 24.25,32.19 24.25,31.06